# Altium schematic sheet STC15F204_SOP28_Clock_TH_24G.SchDoc
size A4; Organization: Altium Limited; Address1: L3, 12a Rodborough Rd; Address2: Frenchs Forest; Address3: NSW; Address4: Australia 2086
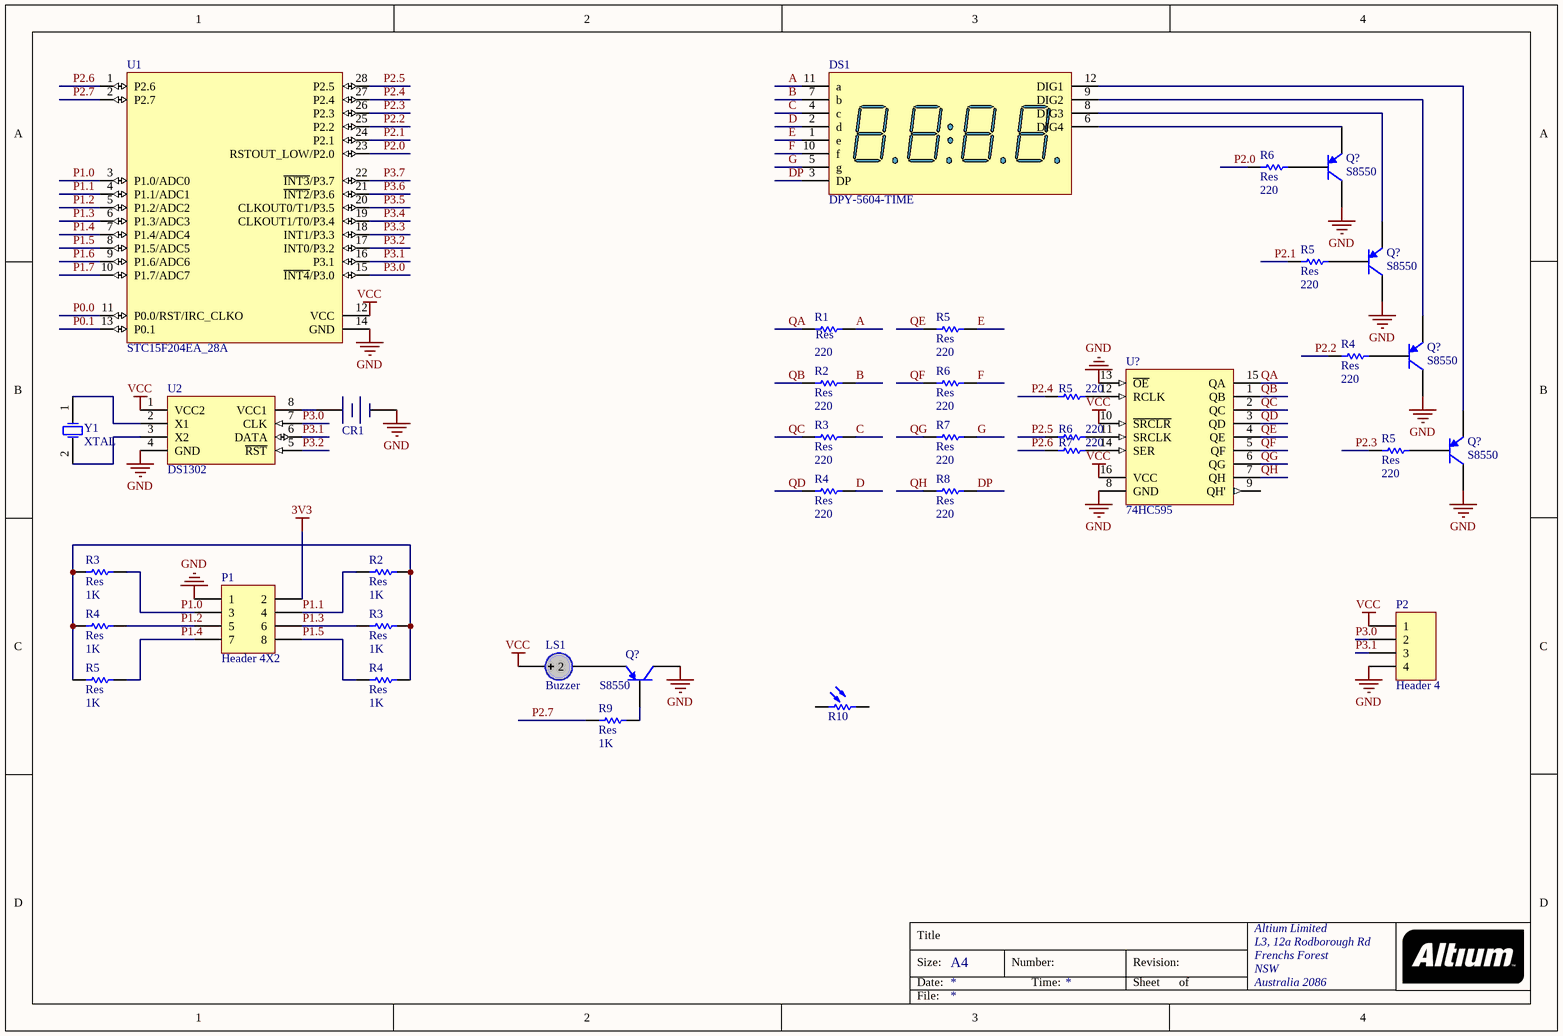
[diagram p0: STC15F204_SOP28_Clock_TH_24G.SchDoc]

## Parts
(Parts that share a designator on the sheet are numbered #1, #2 ... from top to bottom, then left to right.)
CR1  CR  [CR2032]  (value not drawn)
DS1  DPY-5604-TIME  [DPY-5604]
LS1  Buzzer  [Buzzer]
P1  Header 4X2  [HDR2X4]
P2  Header 4  [HDR1X4]
Q?#1  S8550  [SOT-23]
Q?#2  S8550  [SOT-23]
Q?#3  S8550  [SOT-23]
Q?#4  S8550  [SOT-23]
Q?#5  S8550  [SOT-23]
R1  Res  value 220  [0805]
R2#1  Res  value 220  [0805]
R2#2  Res  value 1K  [0805]
R3#1  Res  value 220  [0805]
R3#2  Res  value 1K  [0805]
R3#3  Res  value 1K  [0805]
R4#1  Res  value 220  [0805]
R4#2  Res  value 220  [0805]
R4#3  Res  value 1K  [0805]
R4#4  Res  value 1K  [0805]
R5#1  Res  value 220  [0805]
R5#2  Res  value 220  [0805]
R5#3  value 220  [0805]  (hidden comment: Res)
R5#4  Res  value 220  [0805]
R5#5  Res  value 1K  [0805]
R6#1  Res  value 220  [0805]
R6#2  Res  value 220  [0805]
R6#3  value 220  [0805]  (hidden comment: Res)
R7#1  Res  value 220  [0805]
R7#2  value 220  [0805]  (hidden comment: Res)
R8  Res  value 220  [0805]
R9  Res  value 1K  [0805]
R10  RES_5MM  [RES_5MM]  (value not drawn)
U1  STC15F204EA_28A  [SKDIP28]
U2  DS1302  [DIP8]
U?  74HC595  [DIP16]
Y1  XTAL  [XTAL1]

## Nets
3V3: P1.2
GND: CR1.2(GND) P1.1 P2.4 Q?#1.3(C) Q?#2.3(C) Q?#3.3(C) Q?#4.3(C) Q?#5.3(C) U1.14(GND) U2.4(GND) U?.8(GND) U?.13(~{OE})
VCC: LS1.1 P2.1 U1.12(VCC) U2.1(VCC2) U?.10(~{SRCLR}) U?.16(VCC)
A: DS1.11(a) R1.2
B: DS1.7(b) R2#1.2
C: DS1.4(c) R3#1.2
D: DS1.2(d) R4#2.2
DP: DS1.3(DP) R8.2
E: DS1.1(e) R5#2.2
F: DS1.10(f) R6#2.2
G: DS1.5(g) R7#1.2
P0.0: U1.11(P0.0/RST/IRC_CLKO)
P0.1: U1.13(P0.1)
P1.0: P1.3 R3#2.2 U1.3(P1.0/ADC0)
P1.1: P1.4 R2#2.1 U1.4(P1.1/ADC1)
P1.2: P1.5 R4#3.2 U1.5(P1.2/ADC2)
P1.3: P1.6 R3#3.1 U1.6(P1.3/ADC3)
P1.4: P1.7 R5#5.2 U1.7(P1.4/ADC4)
P1.5: P1.8 R4#4.1 U1.8(P1.5/ADC5)
P1.6: U1.9(P1.6/ADC6)
P1.7: U1.10(P1.7/ADC7)
P2.0: R6#1.1 U1.23(RSTOUT_LOW/P2.0)
P2.1: R5#1.1 U1.24(P2.1)
P2.2: R4#1.1 U1.25(P2.2)
P2.3: R5#4.1 U1.26(P2.3)
P2.4: R5#3.1 U1.27(P2.4)
P2.5: R6#3.1 U1.28(P2.5)
P2.6: R7#2.1 U1.1(P2.6)
P2.7: R9.1 U1.2(P2.7)
P3.0: P2.2 U1.15(~{INT4}/P3.0) U2.7(CLK)
P3.1: P2.3 U1.16(P3.1) U2.6(DATA)
P3.2: U1.17(INT0/P3.2) U2.5(~{RST})
P3.3: U1.18(INT1/P3.3)
P3.4: U1.19(CLKOUT1/T0/P3.4)
P3.5: U1.20(CLKOUT0/T1/P3.5)
P3.6: U1.21(~{INT2}/P3.6)
P3.7: U1.22(~{INT3}/P3.7)
QA: R1.1 U?.15(QA)
QB: R2#1.1 U?.1(QB)
QC: R3#1.1 U?.2(QC)
QD: R4#2.1 U?.3(QD)
QE: R5#2.1 U?.4(QE)
QF: R6#2.1 U?.5(QF)
QG: R7#1.1 U?.6(QG)
QH: R8.1 U?.7(QH)
NetCR1_1: CR1.1(VCC) U2.8(VCC1)
NetDS1_6: DS1.6(DIG4) Q?#1.1(E)
NetDS1_8: DS1.8(DIG3) Q?#2.1(E)
NetDS1_9: DS1.9(DIG2) Q?#3.1(E)
NetDS1_12: DS1.12(DIG1) Q?#4.1(E)
NetLS1_2: LS1.2 Q?#5.1(E)
NetQ?#1_2: Q?#1.2(B) R6#1.2
NetQ?#2_2: Q?#2.2(B) R5#1.2
NetQ?#3_2: Q?#3.2(B) R4#1.2
NetQ?#4_2: Q?#4.2(B) R5#4.2
NetQ?#5_2: Q?#5.2(B) R9.2
NetR2#2_2: R2#2.2 R3#2.1 R3#3.2 R4#3.1 R4#4.2 R5#5.1
NetR5#3_2: R5#3.2 U?.12(RCLK)
NetR6#3_2: R6#3.2 U?.11(SRCLK)
NetR7#2_2: R7#2.2 U?.14(SER)
NetU2_2: U2.2(X1) Y1.1(OSC1)
NetU2_3: U2.3(X2) Y1.2(OSC2)

Not connected (* = marked no-connect by the designer): R10 1 2; U? 9(QH')

## Notes on the sheet
- Title
- Size:
- Date:
- A4
- Number:
- Time:
- Revision:
- Sheet
- of
- File:

## Library data of the parts
CR1 = CR: 电池座
DS1 = DPY-5604-TIME: 0.56英寸4位时间格式数码管; MinimumIntensity: 2020 ucd; Note: IF = 10 mA; Colour: Blue; Published: 8-Jun-2000; LatestRevisionDate: 17-Dec-2003; LatestRevisionNote: Schematic revised, PCB Footprint replaced.; DatasheetDocument: 24-Sep-2002; PackageDocument: 24-Sep-2002; PackageReference: H; Publisher: Altium Limited; ComponentLink1Description: Manufacturer Link; ComponentLink1URL: http://www.agilent.com/
LS1 = Buzzer: 蜂鸣
P1 = Header 4X2: Header, 4-Pin, Dual row; LatestRevisionDate: 17-Jul-2002; LatestRevisionNote: Re-released for DXP Platform.; Publisher: Altium Limited
P2 = Header 4: Header, 4-Pin; LatestRevisionDate: 17-Jul-2002; LatestRevisionNote: Re-released for DXP Platform.; Publisher: Altium Limited
Q?#1-Q?#5 = S8550: PNP 三极管
R1 R2#1 R2#2 R3#1-R3#3 R4#1-R4#4 R5#1-R5#5 R6#1-R6#3 R7#1 R7#2 R8 R9 = Res: Resistor; Published: 8-Jun-2000; LatestRevisionDate: 17-Jul-2002; LatestRevisionNote: Re-released for DXP Platform.; PackageReference: AXIAL-0.3; Publisher: Altium Limited; PackageDescription: Axial Device, Thru-Hole; 2 Leads; 0.3 in Pin Spacing
R10 = RES_5MM: 光敏电阻; Value: 1K; Published: 8-Jun-2000; LatestRevisionDate: 17-Jul-2002; LatestRevisionNote: Re-released for DXP Platform.; PackageReference: AXIAL-0.3; Publisher: Altium Limited
U1 = STC15F204EA_28A: 增强型8051单片机
U2 = DS1302: 涓流充电的时钟芯片; Published: 13-Oct-2000; LatestRevisionDate: 06-Jun-2005; LatestRevisionNote: Stylized 3D Model Added.; DatasheetVersion: 2-Jul-1999; PackageVersion: 1999; PackageReference: DIP8; Publisher: Altium Limited; PackageDescription: DIP; 8 Leads; Row Spacing 7.62 mm; Pitch 2.54 mm; ComponentLink1Description: Manufacturer Link; ComponentLink1URL: http://www.maxim-ic.com/; ComponentLink2Description: Datasheet; ComponentLink2URL: http://pdfserv.maxim-ic.com/en/ds/DS1302.pdf
U? = 74HC595: 8位移位/三态输出寄存器; Published: 8-Jun-2000; LatestRevisionDate: 13-Apr-2006; LatestRevisionNote: IPC-7351 Footprint Added.; DatasheetVersion: May-1997; PackageVersion: Jan-1998; PackageReference: D016; Publisher: Altium Limited; PackageDescription: 16-Pin Small Outline Integrated Circuit 1.27 mm Pitch; Code_IPC: SOIC127P600-16; ComponentLink1Description: Manufacturer Link; ComponentLink1URL: http://www.ti.com/; ComponentLink2Description: Datasheet; ComponentLink2URL: http://www-s.ti.com/sc/ds/sn74hc595.pdf
Y1 = XTAL: Crystal Oscillator; Published: 8-Jun-2000; LatestRevisionDate: 17-Jul-2002; LatestRevisionNote: Re-released for DXP Platform.; PackageReference: R38; Publisher: Altium Limited; PackageDescription: Crystal, Thru-Hole; 2 Leads; Body 3.1 x 8.2 mm (Dia.xH)